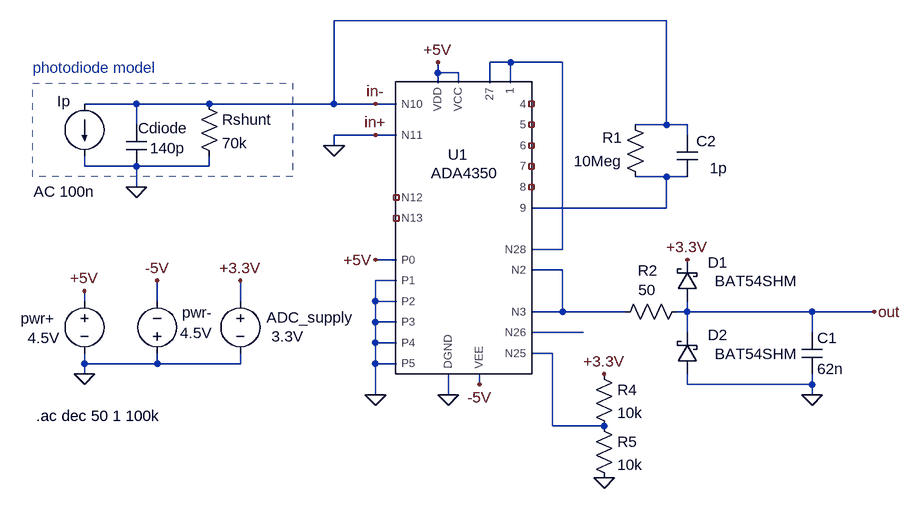
[diagram p0: schematic ADA4350_test.asc]
ADA4350_test.asc, the LTspice schematic file:
Version 4
SHEET 1 1040 680
WIRE 512 -128 0 -128
WIRE 272 -64 240 -64
WIRE 352 -64 272 -64
WIRE 160 -48 160 -64
WIRE 192 -48 160 -48
WIRE 160 -32 160 -48
WIRE 192 -32 192 -48
WIRE 240 -32 240 -64
WIRE 272 -32 272 -64
WIRE -304 0 -384 0
WIRE -192 0 -304 0
WIRE 0 0 0 -128
WIRE 0 0 -192 0
WIRE 64 0 0 0
WIRE 96 0 64 0
WIRE -304 32 -304 0
WIRE 512 32 512 -128
WIRE 512 32 464 32
WIRE 544 32 512 32
WIRE 64 48 0 48
WIRE 96 48 64 48
WIRE 544 48 544 32
WIRE 0 64 0 48
WIRE -384 96 -384 80
WIRE -304 96 -384 96
WIRE -192 96 -192 80
WIRE -192 96 -304 96
WIRE 512 112 464 112
WIRE 544 112 512 112
WIRE -304 128 -304 96
WIRE 512 160 512 112
WIRE 512 160 304 160
WIRE 352 224 352 -64
WIRE 352 224 304 224
WIRE 96 240 64 240
WIRE 352 256 304 256
WIRE 96 272 64 272
WIRE -384 304 -384 288
WIRE -272 304 -272 272
WIRE -144 304 -144 272
WIRE 64 304 64 272
WIRE 96 304 64 304
WIRE 352 320 352 256
WIRE 352 320 304 320
WIRE 448 320 352 320
WIRE 544 320 544 304
WIRE 544 320 528 320
WIRE 736 320 544 320
WIRE 832 320 736 320
WIRE 64 336 64 304
WIRE 96 336 64 336
WIRE 384 352 304 352
WIRE 544 352 544 320
WIRE 736 352 736 320
WIRE 64 368 64 336
WIRE 96 368 64 368
WIRE 336 384 304 384
WIRE -384 400 -384 384
WIRE -272 400 -272 384
WIRE -272 400 -384 400
WIRE -144 400 -144 384
WIRE -144 400 -272 400
WIRE 64 400 64 368
WIRE 96 400 64 400
WIRE -384 416 -384 400
WIRE 224 432 224 416
WIRE 544 432 544 416
WIRE 736 432 736 416
WIRE 736 432 544 432
WIRE 64 448 64 400
WIRE 176 448 176 416
WIRE 736 448 736 432
WIRE 336 496 336 384
WIRE 416 496 336 496
FLAG -384 416 0
FLAG -384 288 +5V
FLAG -304 128 0
FLAG 160 -64 +5V
FLAG 176 448 0
FLAG 64 448 0
FLAG 64 240 +5V
FLAG 832 320 out
FLAG 64 0 in-
FLAG 64 48 in+
FLAG -272 272 -5V
FLAG -144 272 +3.3V
FLAG 544 240 +3.3V
FLAG 0 64 0
FLAG 224 432 -5V
FLAG 736 448 0
FLAG 416 576 0
FLAG 416 416 +3.3V
SYMBOL voltage -384 288 R0
WINDOW 0 -98 42 Left 2
WINDOW 3 -87 72 Left 2
WINDOW 123 0 0 Left 0
WINDOW 39 -119 62 Left 2
SYMATTR InstName pwr+
SYMATTR Value 4.5V
SYMBOL cap -320 32 R0
WINDOW 3 37 36 Left 2
WINDOW 0 19 5 Left 2
SYMATTR Value 140p
SYMATTR InstName Cdiode
SYMBOL res 480 128 R180
WINDOW 0 36 76 Left 2
WINDOW 3 36 40 Left 2
SYMATTR InstName R1
SYMATTR Value 10Meg
SYMBOL cap 560 112 R180
WINDOW 0 -29 55 Left 2
WINDOW 3 -46 13 Left 2
SYMATTR InstName C2
SYMATTR Value 1p
SYMBOL SpecialFunctions\\ADA4350 160 128 R0
SYMATTR InstName U1
SYMBOL current -384 0 R0
WINDOW 0 -42 -4 Left 2
WINDOW 3 -84 164 Left 2
WINDOW 123 -78 135 Left 2
WINDOW 39 0 0 Left 0
SYMATTR InstName Ip
SYMATTR Value ""
SYMATTR Value2 AC 100n
SYMBOL res -208 -16 R0
SYMATTR InstName Rshunt
SYMATTR Value 70k
SYMBOL voltage -272 400 R180
WINDOW 0 -86 79 Left 2
WINDOW 3 -85 47 Left 2
WINDOW 123 0 0 Left 0
WINDOW 39 0 0 Left 0
SYMATTR InstName pwr-
SYMATTR Value 4.5V
SYMBOL voltage -144 288 R0
WINDOW 0 40 41 Left 2
WINDOW 3 48 70 Left 2
WINDOW 123 0 0 Left 0
WINDOW 39 0 0 Left 0
SYMATTR InstName ADC_supply
SYMATTR Value 3.3V
SYMBOL schottky 560 304 R180
WINDOW 0 -46 60 Left 2
WINDOW 3 -153 31 Left 2
SYMATTR InstName D1
SYMATTR Value BAT54SHM
SYMBOL res 544 304 R90
WINDOW 0 -32 61 VBottom 2
WINDOW 3 -33 62 VTop 2
SYMATTR InstName R2
SYMATTR Value 50
SYMBOL cap 720 352 R0
SYMATTR InstName C1
SYMATTR Value 62n
SYMBOL res 400 400 R0
SYMATTR InstName R4
SYMATTR Value 10k
SYMBOL res 400 480 R0
SYMATTR InstName R5
SYMATTR Value 10k
SYMBOL schottky 560 416 R180
WINDOW 0 -46 60 Left 2
WINDOW 3 -153 31 Left 2
SYMATTR InstName D2
SYMATTR Value BAT54SHM
TEXT -464 -56 Left 2 ;photodiode model
TEXT -458 480 Left 2 !.ac dec 50 1 100k
RECTANGLE Normal -64 112 -464 -32 1

The netlist it stands for:
* ADA4350_test.asc
V§pwr+ +5V 0 4.5V
Cdiode in- 0 140p
R1 N002 in- 10Meg
C2 N002 in- 1p
XU1 in- 0 +5V -5V +5V 0 NC_01 NC_02 +5V 0 0 0 0 0 N005 N004 N003 N003 N001 N001 N001 NC_03 NC_04 NC_05 NC_06 NC_07 N002 ADA4350  ; pins N10 N11 VCC VEE VDD DGND N12 N13 P0 P1 P2 P3 P4 P5 N25 N26 N3 N2 N28 27 1 4 5 6 7 8 9
Ip in- 0 AC 100n
Rshunt in- 0 70k
V§pwr- 0 -5V 4.5V
V§ADC_supply +3.3V 0 3.3V
D1 out +3.3V BAT54SHM
R2 out N003 50
C1 out 0 62n
R4 +3.3V N005 10k
R5 N005 0 10k
D2 0 out BAT54SHM
.model D D
.lib standard.dio
* photodiode model
.ac dec 50 1 100k
.lib ADA4350.cir
.backanno
.end